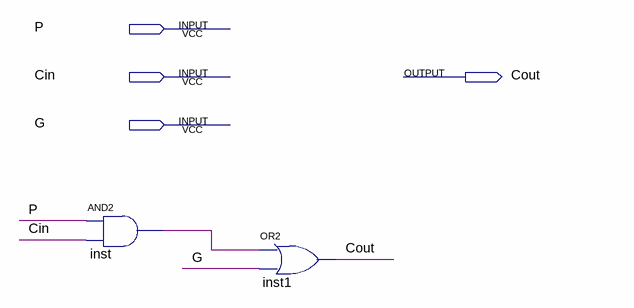
[diagram p0: schematic sheet]
// Quartus schematic carry1bit.bdf as structural Verilog: 2 symbols, 4 pins
module carry1bit (
  input  P,
  input  Cin,
  input  G,
  output Cout
);

  wire inst_out;

  and inst (inst_out, P, Cin);
  or inst1 (Cout, inst_out, G);
endmodule
